# Altium schematic sheet Supply_LDOs.SchDoc: RFSoC AMC
size 420 x 297 mm; CompanyName: WUT; DrawnBy: T. Przywozki; Organization: WUT ISE; Address1: Warsaw University of Technology; Address2: Nowowiejska 15/19 00-665 Warsaw; Address3: Tomasz.Przywozki@pw.edu.pl; DocumentNumber: 22; Revision: 1; SheetNumber: 22; SheetTotal: 45; Project: RFSoC AMC; ModifiedBy: T. Przywozki; CreateDate: -; CheckedDate: -; DivGrp: ISE; Designer: T. Przywozki; ModifiedDate: -; ProjectName: ADC/DAC MEZZANINE
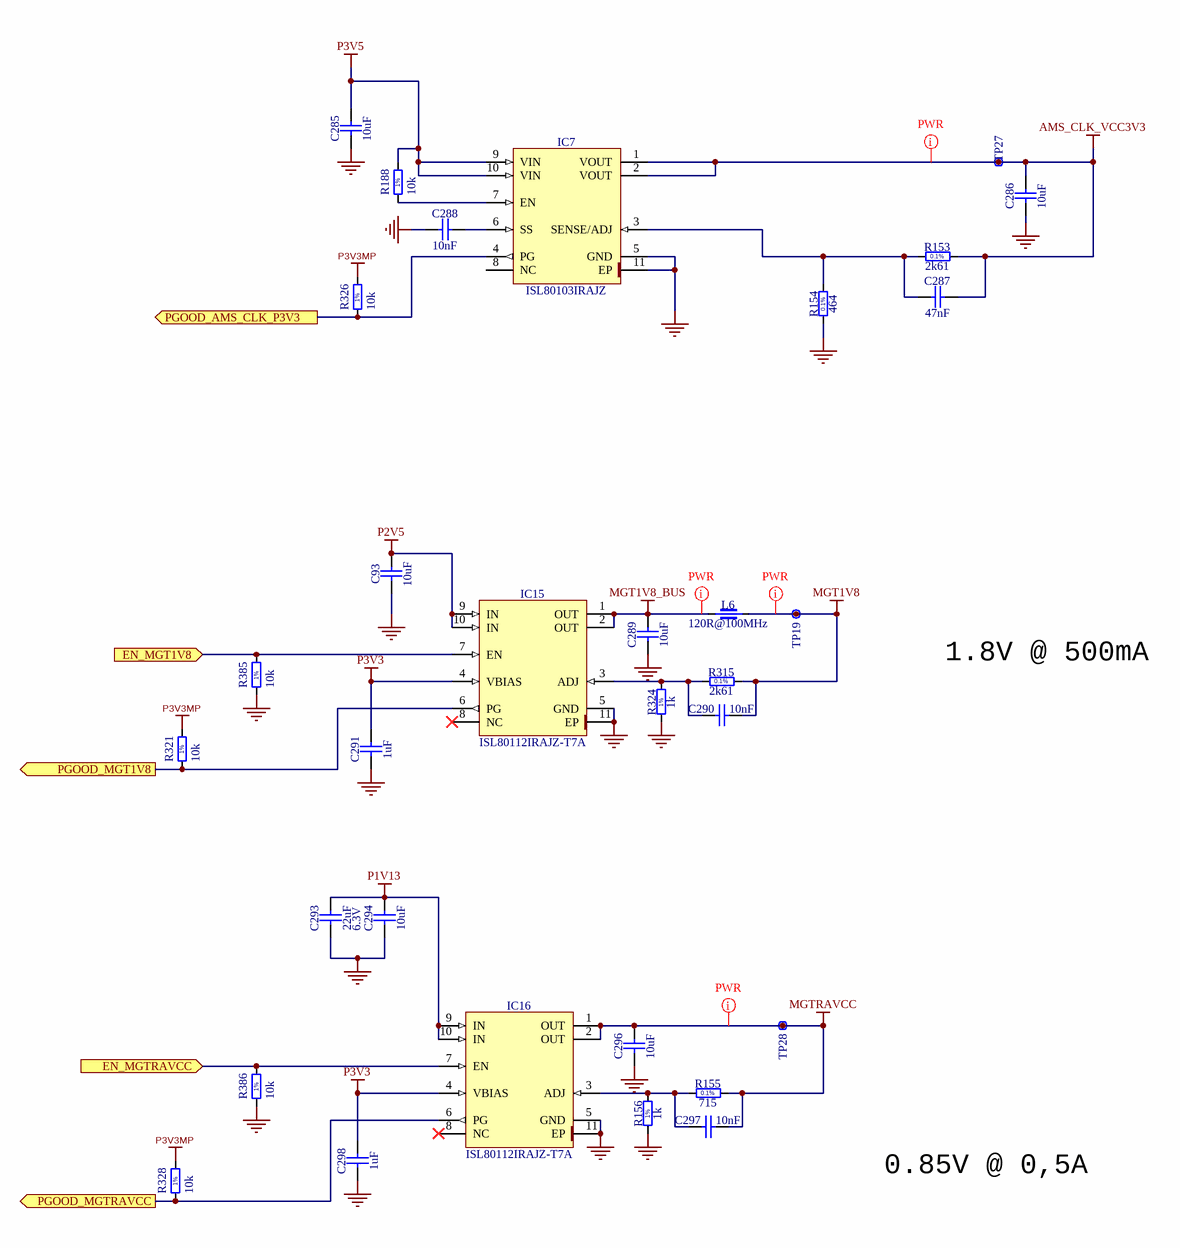
[diagram p0: Supply_LDOs.SchDoc]

## Parts
C93  10uF  [CAPC1608X80N]
C285  10uF  [CAPC1608X80N]
C286  10uF  [CAPC1608X80N]
C287  47nF  [CAPC1005X55N]
C288  10nF  [CAPC1005X55N]
C289  10uF  [CAPC1608X80N]
C290  10nF  [CAPC1005X55N]
C291  1uF  [CAPC1005X55N]
C293  22uF  Voltage: 6.3V  [CAPC1709X100N]
C294  10uF  [CAPC1608X80N]
C296  10uF  [CAPC1608X80N]
C297  10nF  [CAPC1005X55N]
C298  1uF  [CAPC1005X55N]
IC7  ISL80103IRAJZ  [RENESAS_L10.3X3]
IC15  ISL80112IRAJZ-T7A  [RENESAS_L10.3X3]
IC16  ISL80112IRAJZ-T7A  [RENESAS_L10.3X3]
L6  120R@100MHz  [INDC1608X95N]
R153  2k61  [RESC1608X55N]
R154  464  [RESC1608X55N]
R155  715  [RESC1608X55N]
R156  1k  [RESC1608X55N]
R188  10k  [RESC1005X40N]
R315  2k61  [RESC1608X55N]
R321  10k  [RESC1005X40N]
R324  1k  [RESC1608X55N]
R326  10k  [RESC1005X40N]
R328  10k  [RESC1005X40N]
R385  10k  [RESC1005X40N]
R386  10k  [RESC1005X40N]
TP19  Test Point  [TPS127]  (value not drawn)
TP27  Test Point  [TPS127]  (value not drawn)
TP28  Test Point  [TPS127]  (value not drawn)

## Ports
EN_MGT1V8 (in), EN_MGTRAVCC (in), PGOOD_AMS_CLK_P3V3 (out), PGOOD_MGT1V8 (out), PGOOD_MGTRAVCC (out)

## Nets
AMS_CLK_VCC3V3: C286.2 C287.2 IC7.1(VOUT) IC7.2(VOUT) R153.2 TP27.1
GND: C93.1 C285.1 C286.1 C288.1 C289.1 C291.1 C293.1 C294.1 C296.1 C298.1 IC7.5(GND) IC7.11(EP) IC15.5(GND) IC15.11(EP) IC16.5(GND) IC16.11(EP) R154.1 R156.1 R324.1 R385.1 R386.1
MGT1V8: C290.2 L6.2 R315.2 TP19.1
MGT1V8_BUS: C289.2 IC15.1(OUT) IC15.2(OUT) L6.1
MGTRAVCC: C296.2 C297.2 IC16.1(OUT) IC16.2(OUT) R155.2 TP28.1
P1V13: C293.2 C294.2 IC16.9(IN) IC16.10(IN)
P2V5: C93.2 IC15.9(IN) IC15.10(IN)
P3V3: C291.2 C298.2 IC15.4(VBIAS) IC16.4(VBIAS)
P3V3MP: R321.2 R326.2 R328.2
P3V5: C285.2 IC7.9(VIN) IC7.10(VIN) R188.2
EN_MGT1V8: IC15.7(EN) R385.2 ; port EN_MGT1V8
EN_MGTRAVCC: IC16.7(EN) R386.2 ; port EN_MGTRAVCC
PGOOD_AMS_CLK_P3V3: IC7.4(PG) R326.1 ; port PGOOD_AMS_CLK_P3V3
PGOOD_MGT1V8: IC15.6(PG) R321.1 ; port PGOOD_MGT1V8
PGOOD_MGTRAVCC: IC16.6(PG) R328.1 ; port PGOOD_MGTRAVCC
NetC287_1: C287.1 IC7.3(SENSE/ADJ) R153.1 R154.2
NetC288_2: C288.2 IC7.6(SS)
NetC290_1: C290.1 IC15.3(ADJ) R315.1 R324.2
NetC297_1: C297.1 IC16.3(ADJ) R155.1 R156.2
NetIC7_7: IC7.7(EN) R188.1

Not connected (* = marked no-connect by the designer): IC7 8(NC); IC15 8(NC)*; IC16 8(NC)*

## Layout directives
net class PWR: AMS_CLK_VCC3V3, MGT1V8, MGT1V8_BUS, MGTRAVCC

## Notes on the sheet
- 1.8V @ 500mA
- 0.85V @ 0,5A
- Project/Equipment
- Document
- Designer
- Drawn by
- Check.by
- Copyright WUT ISE 2021
  This documentation describes Open Hardware and is licensed under CERN OHL v.1.1. You may redistribute and modify this documentaction under the terms of the CERN OHL v1.1.
  (http://ohwr.org/CERNOHL). This documentation is dristributed WITHOUT ANY EXPRESS OR IMPLIED WARRANTY, INCLUDING OF MERCHANTABLITY, SATISFACTORY QUALITY AND FITNESS FOR A PARTICULAR PURPOSE. Please see the CERN OHL v.1.1 for applicable conditions
- File
- Last Mod.
- Print Date
- Sheet
- Size
- A3
- of
- Rev
- Contact:
- (in symbol R0402_10K_1%_0.0625W_100PPM) 1%
- (in symbol R0603_1K_1%_0.1W_100PPM) 1%
- (in symbol R0603_2K61_0.1%_0.063W_10PPM) 0.1%
- (in symbol R0603_464R_0.1%_0.063W_10PPM) 0.1%
- (in symbol R0603_715R_0.1%_0.063W_10PPM) 0.1%

## Library data of the parts
C93 C285 C286 C289 C294 C296 = CC0603_10UF_10V_10%_X5R: Non-polarised capacitor; Part Description: SMD Multilayer Chip Ceramic Capacitor; Manufacturer: GENERIC; Manufacturer1 Part Number: GRM188R61A106KE69D; Voltage: 10V; TC: X5R; Tolerance: ±10%; Part Number: CC0603_10UF_10V_10%_X5R; Component Kind: Standard; Component Type: Standard; Pin Count: 2; Value: 10uF; Status: None; Manufacturer Part Number: CC0603_10UF_10V_10%_X5R; Case: 0603; Mounted: Yes; Socket: No; SMD: Yes; Sense: No; Manufacturer1 Example: MURATA; Manufacturer1 ComponentHeight: 0.8mm; HelpURL: \\cern.ch\dfs\Applications\Altium\Datasheets\CC0603_MURATA_GRM188R61A106KE69D.pdf; Author: CERN DEM JLC; CreateDate: 31.01.2017; LatestRevisionDate: 31.01.2017
C287 = CC0402_47NF_16V_10%_X7R: Non-polarised capacitor; Part Description: SMD Multilayer Chip Ceramic Capacitor; Manufacturer: GENERIC; Manufacturer1 Part Number: 223878715645; Voltage: 16V; TC: X7R; Tolerance: ±10%; Part Number: CC0402_47NF_16V_10%_X7R; Component Kind: Standard; Component Type: Standard; Pin Count: 2; Value: 47nF; Status: Not Recommended; Manufacturer Part Number: CC0402_47NF_16V_10%_X7R; Case: 0402; Mounted: Yes; Socket: No; SMD: Yes; Sense: No; Manufacturer1 Example: PHYCOMP; Manufacturer1 ComponentHeight: 0.55mm; HelpURL: \\cern.ch\dfs\Applications\Altium\Datasheets\CC0402_X7R_PHYCOMP.pdf; Author: CERN DEM JLC; CreateDate: 03.12.2007; LatestRevisionDate: 03.12.2007
C288 = CC0402_10NF_16V_10%_X7R: Non-polarised capacitor; Part Description: SMD Multilayer Chip Ceramic Capacitor; Manufacturer: GENERIC; Manufacturer1 Part Number: 223878715636; Voltage: 16V; TC: X7R; Tolerance: ±10%; Part Number: CC0402_10NF_16V_10%_X7R; Component Kind: Standard; Component Type: Standard; Pin Count: 2; Value: 10nF; Status: Not Recommended; Manufacturer Part Number: CC0402_10NF_16V_10%_X7R; Case: 0402; Mounted: Yes; Socket: No; SMD: Yes; Sense: No; Manufacturer1 Example: PHYCOMP; Manufacturer1 ComponentHeight: 0.55mm; HelpURL: \\cern.ch\dfs\Applications\Altium\Datasheets\CC0402_X7R_PHYCOMP.pdf; Author: CERN DEM JLC; CreateDate: 03.12.2007; LatestRevisionDate: 03.12.2007
C290 C297 = CC0402_10NF_25V_10%_X7R: Non-polarised capacitor; Part Description: SMD Multilayer Chip Ceramic Capacitor; Manufacturer: GENERIC; Manufacturer1 Part Number: C1005X7R1E103KT; Voltage: 25V; TC: X7R; Tolerance: ±10%; Part Number: CC0402_10NF_25V_10%_X7R; Component Kind: Standard; Component Type: Standard; Pin Count: 2; Value: 10nF; Status: Preferred; Manufacturer Part Number: CC0402_10NF_25V_10%_X7R; Case: 0402; Mounted: Yes; Socket: No; SMD: Yes; Sense: No; Manufacturer1 Example: TDK; Manufacturer1 ComponentHeight: 0.55mm; HelpURL: \\cern.ch\dfs\Applications\Altium\Datasheets\CC0402_X7R_TDK_C.pdf; Author: CERN DEM JLC; CreateDate: 25.10.2012; LatestRevisionDate: 25.10.2012
C291 C298 = CC0402_1UF_16V_10%_X5R: Non-polarised capacitor; Part Description: SMD Multilayer Chip Ceramic Capacitor; Manufacturer: GENERIC; Manufacturer1 Part Number: C1005X5R1C105KT; Voltage: 16V; TC: X5R; Tolerance: ±10%; Part Number: CC0402_1UF_16V_10%_X5R; Component Kind: Standard; Component Type: Standard; Pin Count: 2; Value: 1uF; Status: Preferred; Manufacturer Part Number: CC0402_1UF_16V_10%_X5R; Case: 0402; Mounted: Yes; Socket: No; SMD: Yes; Sense: No; Manufacturer1 Example: TDK; Manufacturer1 ComponentHeight: 0.55mm; HelpURL: \\cern.ch\dfs\Applications\Altium\Datasheets\CC0402_X5R_TDK_C.pdf; Author: CERN DEM JLC; CreateDate: 25.10.2012; LatestRevisionDate: 25.10.2012
C293 = CC0603_22UF_6.3V_20%_X5R: Non-polarised capacitor; Part Description: SMD Multilayer Chip Ceramic Capacitor; Manufacturer: GENERIC; Manufacturer1 Part Number: C1608X5R0J226M080AC; TC: X5R; Tolerance: ±20%; Part Number: CC0603_22UF_6.3V_20%_X5R; Component Kind: Standard; Component Type: Standard; Pin Count: 2; Value: 22uF; Status: None; Manufacturer Part Number: CC0603_22UF_6.3V_20%_X5R; Case: 0603; Mounted: Yes; Socket: No; SMD: Yes; Sense: No; Manufacturer1 Example: TDK; Manufacturer1 ComponentHeight: 1mm; HelpURL: \\cern.ch\dfs\Applications\Altium\Datasheets\CC0603_X5R_TDK_C.pdf; Author: CERN DEM JLC; CreateDate: 16.12.2013; LatestRevisionDate: 13.09.2016
IC7 = ISL80103IRAJZ: High Performance 3A Linear Regulators; Manufacturer: RENESAS ELECTRONICS; PressFit: No; Bonding: No; Part Number: ISL80103IRAJZ; Component Kind: Standard; Component Type: Standard; Device: ISL80103IRAJZ; PackageDescription: SON(DFN), 0.50mm Pitch, Square; 10 Pin, 3.00mm L X 3.00mm W X 1.00mm H body (w/Thermal Tab 1.60 x2.00mm); Part Description: High Performance 3A Linear Regulators; Manufacturer Part Number: ISL80103IRAJZ; Pin Count: 11; Case: SON10; Mounted: Yes; Socket: No; SMD: Yes; Sense: No; ComponentHeight: 1mm; HelpURL: \\cern.ch\dfs\Applications\Altium\Datasheets\ISL80103IRAJZ.pdf; Author: CERN DEM MR; CreateDate: 23.04.2019; LatestRevisionDate: 23.04.2019
IC15 IC16 = ISL80112IRAJZ-T7A: Ultra Low Dropout Low Input Voltage NMOS LDO Regulator; Part Description: 1V-3.6V to 0.8V-3.3V Ultra Low Dropout 2A Low Input Voltage NMOS LDO Regulator; Manufacturer: RENESAS ELECTRONICS; PressFit: No; Bonding: No; Part Number: ISL80112IRAJZ-T7A; Component Kind: Standard; Component Type: Standard; Device: ISL80112IRAJZ-T7A; PackageDescription: SON(DFN), 0.50mm Pitch, Square; 10 Pin, 3.00mm L X 3.00mm W X 1.00mm H body (w/Thermal Tab 1.60 x2.00mm); Manufacturer Part Number: ISL80112IRAJZ-T7A; Pin Count: 11; Case: SON10; Mounted: Yes; Socket: No; SMD: Yes; Sense: No; ComponentHeight: 1mm; HelpURL: \\cern.ch\dfs\Applications\Altium\Datasheets\ISL80112IRAJZ-T7A.pdf; Author: CERN DEM JLC; CreateDate: 04.12.2018; LatestRevisionDate: 04.12.2018
L6 = IND0603_MURATA_BLM18PG121SN1D: Manufacturer: MURATA; Part Description: SMD EMIFIL Chip Ferrite Bead; Power: 2A; Resistance: 0.05R; Case: 0603; ComponentHeight: 0.95mm; Manufacturer Part Number: BLM18PG121SN1D; Part Number: IND0603_MURATA_BLM18PG121SN1D; Pin Count: 2; SMD: Yes; Value: 120R@100MHz; Component Kind: Standard; Component Type: Standard; Status: None; Mounted: Yes; Socket: No; Sense: No; HelpURL: \\cern.ch\dfs\Applications\Altium\Datasheets\IND0603_MURATA_BLM18P.pdf; Author: CERN DEM BC; CreateDate: 27.07.2015; LatestRevisionDate: 25.10.2018
R153 R315 = R0603_2K61_0.1%_0.063W_10PPM: Resistor - 0.1%; Part Description: Thin Film Chip Resistor; Manufacturer: GENERIC; Manufacturer1 Part Number: RN73C1J2K61BTDF; Power: 0.063W; TC: ±10ppm; PressFit: No; Part Number: R0603_2K61_0.1%_0.063W_10PPM; Component Kind: Standard; Component Type: Standard; Pin Count: 2; Value: 2k61; Status: Not Recommended; Tolerance: ±0.1%; Manufacturer Part Number: R0603_2K61_0.1%_0.063W_10PPM; Case: 0603; Mounted: Yes; Sense: No; Socket: No; SMD: Yes; Manufacturer1 Example: TYCO HOLSWORTHY; Manufacturer1 ComponentHeight: 0.5mm; HelpURL: \\cern.ch\dfs\Applications\Altium\Datasheets\R0603_Tyco_RN73.pdf; Author: CERN DEM JLC; CreateDate: 03.12.2007; LatestRevisionDate: 13.03.2008
R154 = R0603_464R_0.1%_0.063W_10PPM: Resistor - 0.1%; Part Description: Thin Film Chip Resistor; Manufacturer: GENERIC; Manufacturer1 Part Number: RN73C1J464RBTDF; Power: 0.063W; TC: ±10ppm; PressFit: No; Part Number: R0603_464R_0.1%_0.063W_10PPM; Component Kind: Standard; Component Type: Standard; Pin Count: 2; Value: 464; Status: Not Recommended; Tolerance: ±0.1%; Manufacturer Part Number: R0603_464R_0.1%_0.063W_10PPM; Case: 0603; Mounted: Yes; Sense: No; Socket: No; SMD: Yes; Manufacturer1 Example: TYCO HOLSWORTHY; Manufacturer1 ComponentHeight: 0.5mm; HelpURL: \\cern.ch\dfs\Applications\Altium\Datasheets\R0603_Tyco_RN73.pdf; Author: CERN DEM JLC; CreateDate: 03.12.2007; LatestRevisionDate: 13.03.2008
R155 = R0603_715R_0.1%_0.063W_10PPM: Resistor - 0.1%; Part Description: Thin Film Chip Resistor; Manufacturer: GENERIC; Manufacturer1 Part Number: RN73C1J715RBTDF; Power: 0.063W; TC: ±10ppm; PressFit: No; Part Number: R0603_715R_0.1%_0.063W_10PPM; Component Kind: Standard; Component Type: Standard; Pin Count: 2; Value: 715; Status: Not Recommended; Tolerance: ±0.1%; Manufacturer Part Number: R0603_715R_0.1%_0.063W_10PPM; Case: 0603; Mounted: Yes; Sense: No; Socket: No; SMD: Yes; Manufacturer1 Example: TYCO HOLSWORTHY; Manufacturer1 ComponentHeight: 0.5mm; HelpURL: \\cern.ch\dfs\Applications\Altium\Datasheets\R0603_Tyco_RN73.pdf; Author: CERN DEM JLC; CreateDate: 03.12.2007; LatestRevisionDate: 13.03.2008
R156 R324 = R0603_1K_1%_0.1W_100PPM: Resistor - 1%; Part Description: General Purpose Thick Film Chip Resistor; Manufacturer: GENERIC; Manufacturer1 Part Number: NRC06F1001TRF; Power: 0.1W; TC: ±100ppm/°C; PressFit: No; Part Number: R0603_1K_1%_0.1W_100PPM; Component Kind: Standard; Component Type: Standard; Pin Count: 2; Value: 1k; Status: Preferred; Tolerance: ±1%; Manufacturer Part Number: R0603_1K_1%_0.1W_100PPM; Case: 0603; Mounted: Yes; Sense: No; Socket: No; SMD: Yes; Manufacturer1 Example: NIC COMPONENT; Manufacturer1 ComponentHeight: 0.55mm; HelpURL: \\cern.ch\dfs\Applications\Altium\Datasheets\R0603_NIC_NRC.pdf; Author: CERN DEM JLC; CreateDate: 03.12.2007; LatestRevisionDate: 13.03.2008
R188 R321 R326 R328 R385 R386 = R0402_10K_1%_0.0625W_100PPM: Resistor - 1%; Manufacturer: GENERIC; Part Description: General Purpose Thick Film Chip Resistor; Manufacturer1 Part Number: 232270671003L; TC: ±100ppm/°C; PressFit: No; Manufacturer Part Number: R0402_10K_1%_0.0625W_100PPM; Part Number: R0402_10K_1%_0.0625W_100PPM; Tolerance: ±1%; Value: 10k; Component Kind: Standard; Component Type: Standard; Pin Count: 2; Status: Not Recommended; Power: 0.0625W; Case: 0402; Mounted: Yes; Sense: No; Socket: No; SMD: Yes; Manufacturer1 Example: YAGEO PHYCOMP; Manufacturer1 ComponentHeight: 0.4mm; HelpURL: \\cern.ch\dfs\Applications\Altium\Datasheets\R0402_Phycomp_RC0402.pdf; Author: CERN DEM JLC; CreateDate: 03/12/2007; LatestRevisionDate: 17/10/2012
TP19 TP27 TP28 = SMD_PAD_1.27X1.27MM: Part Description: 1.27mm x 1.27mm PCB Copper Area (SMD Test Point); Mounted: No; Part Number: SMD_PAD_1.27X1.27MM; Component Kind: Standard (No BOM); Component Type: Standard (No BOM); Pin Count: 1; Family: Test Point; Socket: No; SMD: Yes; Sense: No; Status: None; ComponentHeight: 0mm; HelpURL: Undefined; Author: CERN DEM JLC; CreateDate: 12.01.2008; LatestRevisionDate: 12.01.2008; PackageDescription: 1.27mm x 1.27mm PCB Copper Area (SMD Test Point)